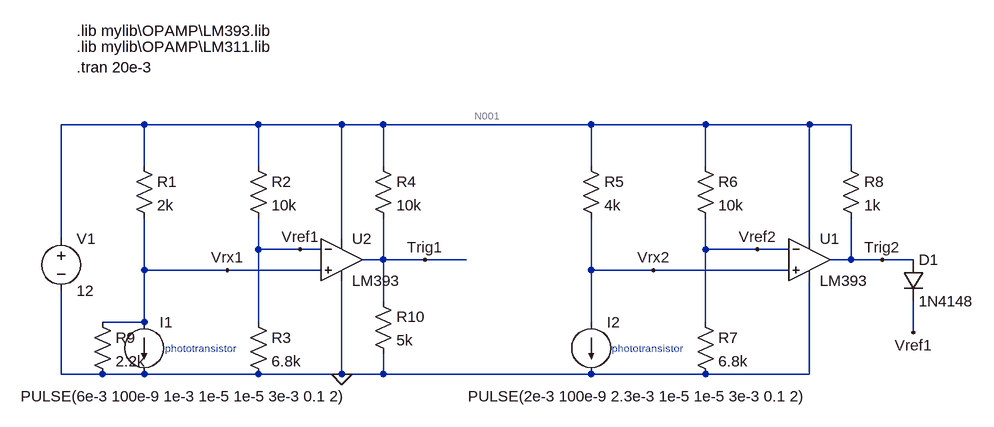
[diagram p0: schematic OpticalSpeedometer.asc]
OpticalSpeedometer.asc, the LTspice schematic file:
Version 4
SHEET 1 1144 680
WIRE -144 -64 -272 -64
WIRE 32 -64 -144 -64
WIRE 160 -64 32 -64
WIRE 224 -64 160 -64
WIRE 544 -64 224 -64
WIRE 720 -64 544 -64
WIRE 880 -64 720 -64
WIRE 944 -64 880 -64
WIRE -144 0 -144 -64
WIRE 32 0 32 -64
WIRE 224 0 224 -64
WIRE 544 0 544 -64
WIRE 720 0 720 -64
WIRE 944 0 944 -64
WIRE -272 112 -272 -64
WIRE 160 112 160 -64
WIRE 880 112 880 -64
WIRE 32 128 32 80
WIRE 96 128 32 128
WIRE 128 128 96 128
WIRE 720 128 720 80
WIRE 800 128 720 128
WIRE 848 128 800 128
WIRE 224 144 224 80
WIRE 224 144 192 144
WIRE 288 144 224 144
WIRE 352 144 288 144
WIRE 944 144 944 80
WIRE 944 144 912 144
WIRE 992 144 944 144
WIRE 1040 144 992 144
WIRE -144 160 -144 80
WIRE -16 160 -144 160
WIRE 128 160 -16 160
WIRE 544 160 544 80
WIRE 640 160 544 160
WIRE 848 160 640 160
WIRE 224 208 224 144
WIRE -144 240 -144 160
WIRE -144 240 -208 240
WIRE 32 240 32 128
WIRE 544 240 544 160
WIRE 720 240 720 128
WIRE 1040 256 1040 208
WIRE -272 320 -272 192
WIRE -208 320 -272 320
WIRE -144 320 -208 320
WIRE 32 320 -144 320
WIRE 160 320 160 176
WIRE 160 320 32 320
WIRE 224 320 224 288
WIRE 224 320 160 320
WIRE 544 320 224 320
WIRE 720 320 544 320
WIRE 880 320 880 176
WIRE 880 320 720 320
FLAG -16 160 Vrx1
FLAG 160 320 0
FLAG 96 128 Vref1
FLAG 288 144 Trig1
FLAG 992 144 Trig2
FLAG 640 160 Vrx2
FLAG 800 128 Vref2
FLAG 1040 256 Vref1
SYMBOL voltage -272 96 R0
WINDOW 123 0 0 Left 0
WINDOW 39 0 0 Left 0
SYMATTR InstName V1
SYMATTR Value 12
SYMBOL current -144 240 R0
WINDOW 3 -190 114 Left 2
WINDOW 123 0 0 Left 0
WINDOW 39 0 0 Left 0
SYMATTR Value PULSE(6e-3 100e-9 1e-3 1e-5 1e-5 3e-3 0.1 2)
SYMATTR InstName I1
SYMBOL res -160 -16 R0
SYMATTR InstName R1
SYMATTR Value 2k
SYMBOL res 16 -16 R0
SYMATTR InstName R2
SYMATTR Value 10k
SYMBOL res 16 224 R0
SYMATTR InstName R3
SYMATTR Value 6.8k
SYMBOL res 208 -16 R0
SYMATTR InstName R4
SYMATTR Value 10k
SYMBOL Opamps\\opamp2 160 80 R0
SYMATTR InstName U2
SYMATTR Value LM393
SYMBOL Opamps\\opamp2 880 80 R0
SYMATTR InstName U1
SYMATTR Value LM393
SYMBOL res 528 -16 R0
SYMATTR InstName R5
SYMATTR Value 4k
SYMBOL res 704 -16 R0
SYMATTR InstName R6
SYMATTR Value 10k
SYMBOL current 544 240 R0
WINDOW 3 -190 114 Left 2
WINDOW 123 0 0 Left 0
WINDOW 39 0 0 Left 0
SYMATTR Value PULSE(2e-3 100e-9 2.3e-3 1e-5 1e-5 3e-3 0.1 2)
SYMATTR InstName I2
SYMBOL res 704 224 R0
SYMATTR InstName R7
SYMATTR Value 6.8k
SYMBOL res 928 -16 R0
SYMATTR InstName R8
SYMATTR Value 1k
SYMBOL res -224 224 R0
SYMATTR InstName R9
SYMATTR Value 2.2k
SYMBOL diode 1024 144 R0
SYMATTR InstName D1
SYMATTR Value 1N4148
SYMBOL res 208 192 R0
SYMATTR InstName R10
SYMATTR Value 5k
TEXT -248 -184 Left 2 !.lib mylib\\OPAMP\\LM311.lib
TEXT -248 -152 Left 2 !.tran 20e-3
TEXT -248 -208 Left 2 !.lib mylib\\OPAMP\\LM393.lib
TEXT -112 280 Left 1 ;phototransistor
TEXT 576 280 Left 1 ;phototransistor

The netlist it stands for:
* OpticalSpeedometer.asc
V1 N001 0 12
I1 Vrx1 0 PULSE(6e-3 100e-9 1e-3 1e-5 1e-5 3e-3 0.1 2)
R1 N001 Vrx1 2k
R2 N001 Vref1 10k
R3 Vref1 0 6.8k
R4 N001 Trig1 10k
XU2 Vrx1 Vref1 N001 0 Trig1 LM393  ; pins In+ In- V+ V- OUT
XU1 Vrx2 Vref2 N001 0 Trig2 LM393  ; pins In+ In- V+ V- OUT
R5 N001 Vrx2 4k
R6 N001 Vref2 10k
I2 Vrx2 0 PULSE(2e-3 100e-9 2.3e-3 1e-5 1e-5 3e-3 0.1 2)
R7 Vref2 0 6.8k
R8 N001 Trig2 1k
R9 Vrx1 0 2.2k
D1 Trig2 Vref1 1N4148
R10 Trig1 0 5k
.model D D
.lib standard.dio
.lib mylib\OPAMP\LM311.lib
.tran 20e-3
.lib mylib\OPAMP\LM393.lib
* phototransistor
* phototransistor
.backanno
.end

* Results of the author's LTspice run, read from the files saved beside the schematic
* Operating Point, zero values left out:
*   V(n001) = 12 V
*   V(vrx1) = 52.36 µV
*   V(vref1) = 4.857 V
*   V(trig1) = 67.91 mV
*   V(vrx2) = 4 V
*   V(vref2) = 4.857 V
*   V(trig2) = 124.2 mV
*   I(D1) = -2.525 nA
*   I(I2) = 2 mA
*   I(I1) = 6 mA
*   I(R10) = 13.58 µA
*   I(R9) = 23.8 nA
*   I(R8) = 11.88 mA
*   I(R7) = 714.3 µA
*   I(R6) = 714.3 µA
*   I(R5) = 2 mA
*   I(R4) = 1.193 mA
*   I(R3) = 714.3 µA
*   I(R2) = 714.3 µA
*   I(R1) = 6 mA
*   I(V1) = -23.02 mA
*   Ix(u2:1) = -49.98 nA
*   Ix(u2:2) = 9.576 pA
*   Ix(u2:3) = 259.2 µA
*   Ix(u2:4) = -1.439 mA
*   Ix(u2:5) = 1.18 mA
*   Ix(u1:1) = -49.97 nA
*   Ix(u1:2) = 5.576 pA
*   Ix(u1:3) = 259.2 µA
*   Ix(u1:4) = -12.14 mA
*   Ix(u1:5) = 11.88 mA
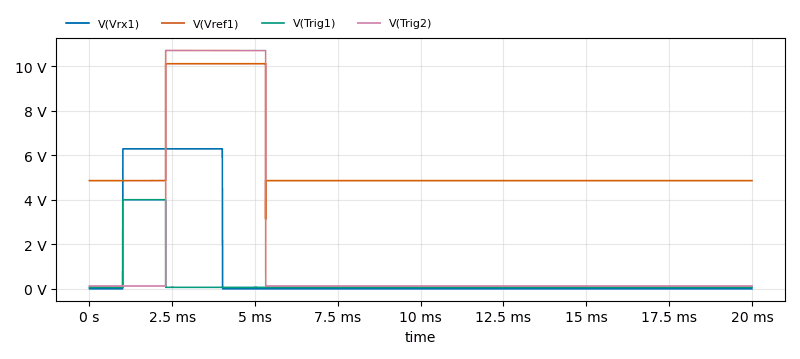
[diagram p1: Transient Analysis of OpticalSpeedometer.asc, plotted from the saved traces]
* Transient Analysis, 1 run:
*   V(Vrx1): min 52.36 µV, max 6.286 V, average 946 mV, rms 2.438 V, last 52.36 µV
*   V(Vref1): min 3.131 V, max 10.12 V, average 5.649 V, rms 5.953 V, last 4.857 V
*   V(Trig1): min 67.91 mV, max 4.001 V, average 322.3 mV, rms 1.019 V, last 67.91 mV
*   V(Trig2): min 124.1 mV, max 10.71 V, average 1.72 V, rms 4.159 V, last 124.2 mV